# EAGLE design BABYBEAR (EAGLE 9.2.1)
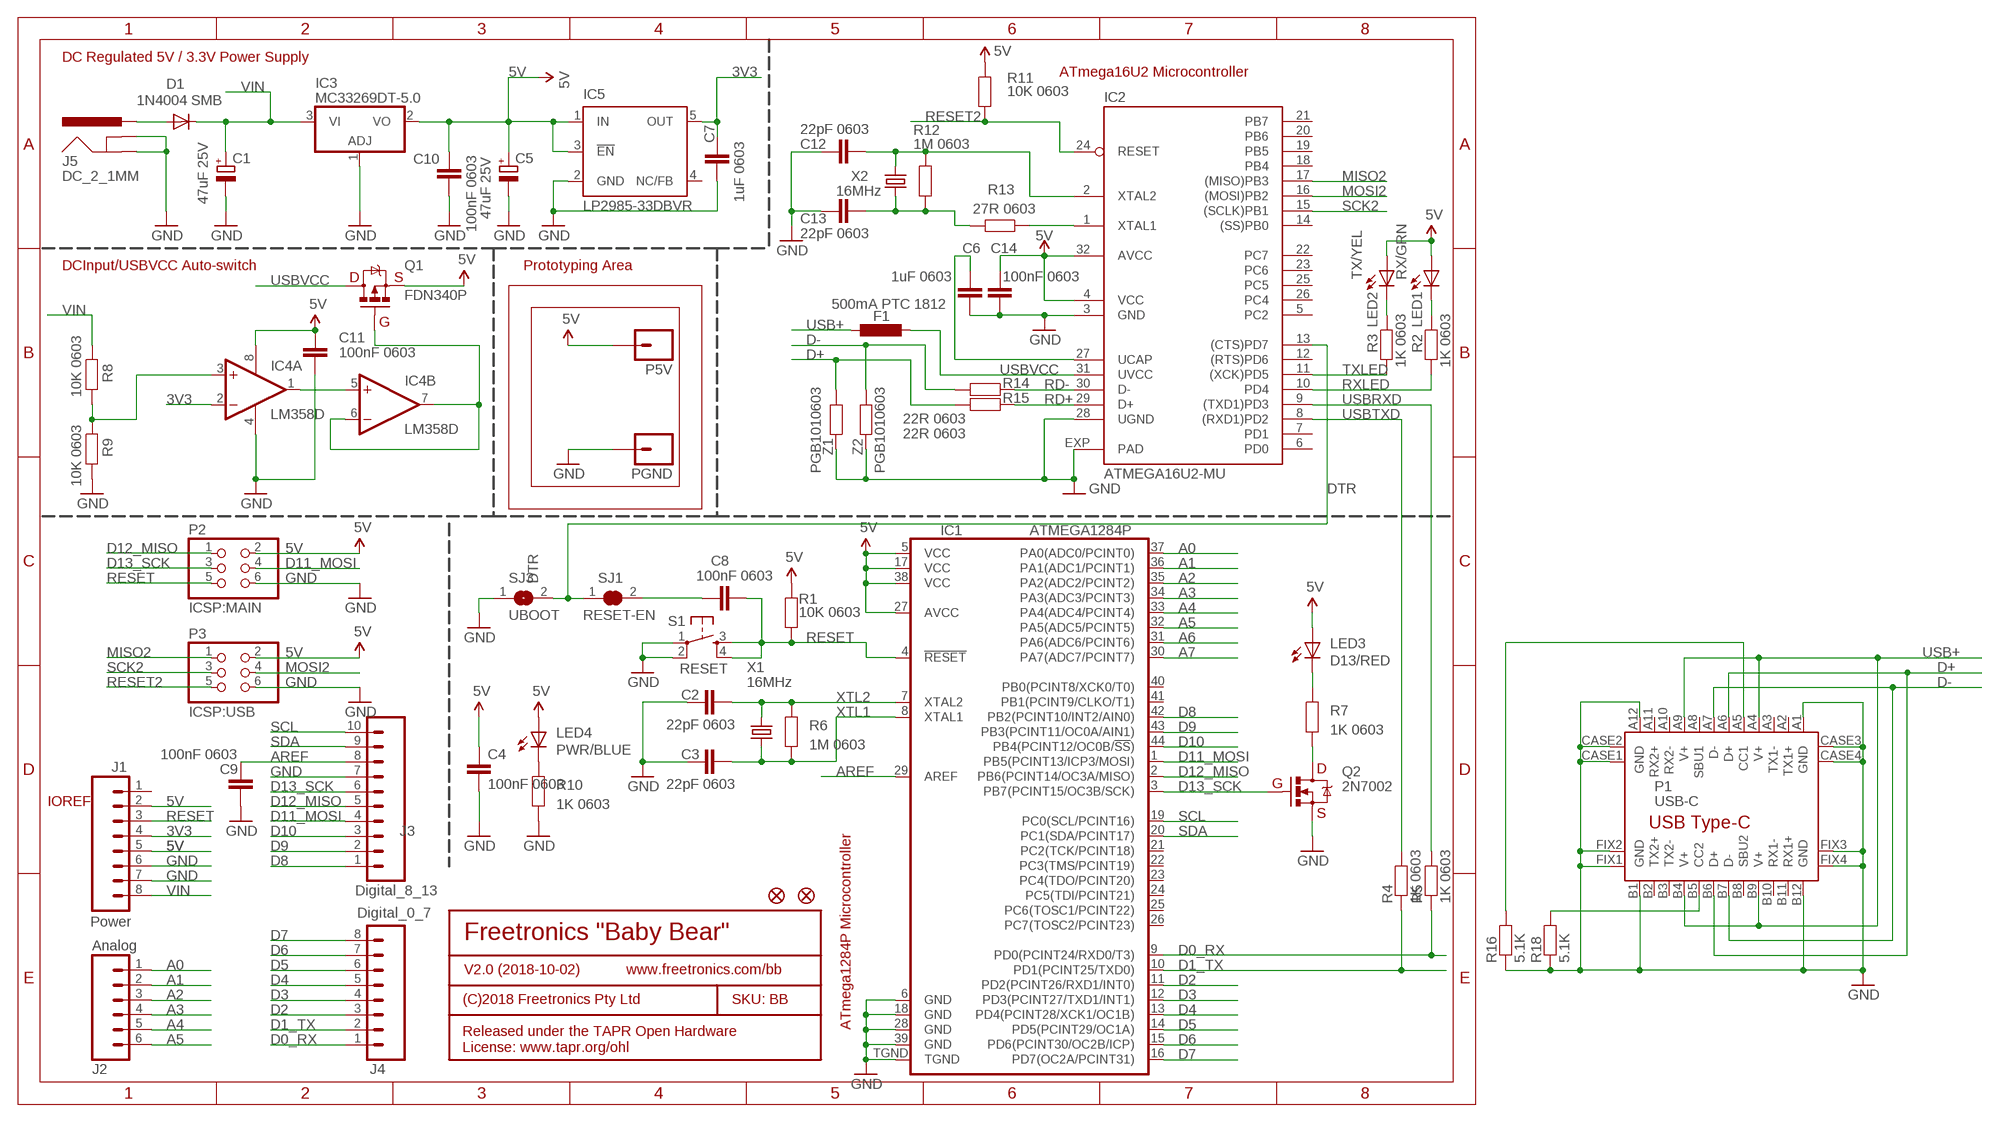
[diagram p0: schematic, sheet 1]

## Parts
C1  47uF 25V  CPOL-EUD  [PANASONIC_D]
C2  22pF 0603  CAP0603  [0603]
C3  22pF 0603  CAP0603  [0603]
C4  100nF 0603  CAP0603  [0603]
C5  47uF 25V  CPOL-EUD  [PANASONIC_D]
C6  1uF 0603  CAP0603  [0603]
C7  1uF 0603  CAP0603  [0603]
C8  100nF 0603  CAP0603  [0603]
C9  100nF 0603  CAP0603  [0603]
C10  100nF 0603  CAP0603  [0603]
C11  100nF 0603  CAP0603  [0603]
C12  22pF 0603  CAP0603  [0603]
C13  22pF 0603  CAP0603  [0603]
C14  100nF 0603  CAP0603  [0603]
D1  1N4004 SMB  DIODESMB  [SMB-DIODE]
F1  500mA PTC 1812  L-EUL1812  [L1812]
IC1  ATMEGA1284P  [QFN-44M1]
IC2  ATMEGA16U2-MU  ATMEL_ATMEGA8U2-MUQFN  [ATMEL_QFN32]
IC3  MC33269DT-5.0  MC33269D-5.0  [DPACK]
IC4  LM358D  [SO08]
IC5  LP2985-33DBVR  TEXAS_TPS77033  [TEXAS_SOT23-DBV]
J1  Power  M08  [1X08]
J2  Analog  M06SIP  [1X06]
J3  Digital_8_13  M100.1  [1X10]
J4  Digital_0_7  M08  [1X08]
J5  DC_2_1MM  POWER_JACKPTH_SLOTS  [POWER_JACK_PTH_SLOTS]
LED1  RX/GRN  LED0603  [LED-0603]
LED2  TX/YEL  LED0603  [LED-0603]
LED3  D13/RED  LED0603  [LED-0603]
LED4  PWR/BLUE  LED0603  [LED-0603]
P1  USB-C  [USB-C-U52A]
P2  ICSP:MAIN  PINHD-2X3  [2X03]
P3  ICSP:USB  PINHD-2X3  [2X03]
P5V  M01SMD  [LUXEON-PAD]
PGND  M01SMD  [LUXEON-PAD]
Q1  FDN340P  MOSFET-PCHANNEL  [SOT23]
Q2  2N7002  MOSFET-NCHANNELSMD  [SOT23-3]
R1  10K 0603  RESISTOR0603  [0603]
R2  1K 0603  RESISTOR0603  [0603]
R3  1K 0603  RESISTOR0603  [0603]
R4  1K 0603  RESISTOR0603  [0603]
R5  1K 0603  RESISTOR0603  [0603]
R6  1M 0603  RESISTOR0603  [0603]
R7  1K 0603  RESISTOR0603  [0603]
R8  10K 0603  RESISTOR0603  [0603]
R9  10K 0603  RESISTOR0603  [0603]
R10  1K 0603  RESISTOR0603  [0603]
R11  10K 0603  RESISTOR0603  [0603]
R12  1M 0603  RESISTOR0603  [0603]
R13  27R 0603  RESISTOR0603  [0603]
R14  22R 0603  RESISTOR0603  [0603]
R15  22R 0603  RESISTOR0603  [0603]
R16  5.1K  RESISTOR0603  [0603]
R18  5.1K  RESISTOR0603  [0603]
S1  RESET  TAC_SWITCHSMD  [TACTILE_SWITCH_SMD]
SJ1  RESET-EN  SJCN  [SJC]
SJ3  UBOOT  SJ  [SJ]
U$5  FIDUCIAL1X2.5  [FIDUCIAL-1X2.5]
U$14  FIDUCIAL1X2.5  [FIDUCIAL-1X2.5]
X1  16MHz  CRYSTALHC49UV  [HC49U-V]
X2  16MHz  CRYSTALHC49UV  [HC49U-V]
Z1  PGB1010603  RESISTOR0603  [0603]
Z2  PGB1010603  RESISTOR0603  [0603]

## Nets
3V3: C7.2 IC4.2(A:-IN) IC5.5(OUT) J1.4
5V: C4.1 C5.+ C10.1 C11.1 C14.1 IC1.5(VCC) IC1.17(VCC) IC1.27(AVCC) IC1.38(VCC) IC2.4(VCC) IC2.32(AVCC) IC3.2(VO) IC4.8(P:V+) IC5.1(IN) IC5.3(!EN) J1.2 J1.5 LED1.A LED2.A LED3.A LED4.A P2.2 P3.2 P5V.P$1 Q1.2(S) R1.2 R11.2
A0: IC1.37(PA0(ADC0/PCINT0)) J2.1
A1: IC1.36(PA1(ADC1/PCINT1)) J2.2
A2: IC1.35(PA2(ADC2/PCINT2)) J2.3
A3: IC1.34(PA3(ADC3/PCINT3)) J2.4
A4: IC1.33(PA4(ADC4/PCINT4)) J2.5
A5: IC1.32(PA5(ADC5/PCINT5)) J2.6
A6: IC1.31(PA6(ADC6/PCINT6))
A7: IC1.30(PA7(ADC7/PCINT7))
AREF: C9.1 IC1.29(AREF) J3.8
D0_RX: IC1.9(PD0(PCINT24/RXD0/T3)) J4.1 R5.1
D1_TX: IC1.10(PD1(PCINT25/TXD0)) J4.2 R4.1
D2: IC1.11(PD2(PCINT26/RXD1/INT0)) J4.3
D3: IC1.12(PD3(PCINT27/TXD1/INT1)) J4.4
D4: IC1.13(PD4(PCINT28/XCK1/OC1B)) J4.5
D5: IC1.14(PD5(PCINT29/OC1A)) J4.6
D6: IC1.15(PD6(PCINT30/OC2B/ICP)) J4.7
D7: IC1.16(PD7(OC2A/PCINT31)) J4.8
D8: IC1.42(PB2(PCINT10/INT2/AIN0)) J3.1
D9: IC1.43(PB3(PCINT11/OC0A/AIN1)) J3.2
D10: IC1.44(PB4(PCINT12/OC0B/!SS!)) J3.3
D11_MOSI: IC1.1(PB5(PCINT13/ICP3/MOSI)) J3.4 P2.4
D12_MISO: IC1.2(PB6(PCINT14/OC3A/MISO)) J3.5 P2.1
D13_SCK: IC1.3(PB7(PCINT15/OC3B/SCK)) J3.6 P2.3 Q2.1(G)
D+: P1.A6(D+) P1.B6(D+) R15.2 Z1.1
D-: P1.A7(D-) P1.B7(D-) R14.2 Z2.1
DTR: IC2.13((CTS)PD7) SJ1.1 SJ3.2
GND: C1.- C2.1 C3.1 C4.2 C5.- C6.2 C7.1 C9.2 C10.2 C11.2 C12.1 C13.1 C14.2 IC1.6(GND) IC1.18(GND) IC1.28(GND) IC1.39(GND) IC1.TGND IC2.3(GND) IC2.28(UGND) IC2.EXP(PAD) IC3.1(ADJ) IC4.4(P:V-) IC5.2(GND) J1.6 J1.7 J3.7 J5.GND J5.GNDBREAK P1.A1(GND) P1.A12(GND) P1.B1(GND) P1.B12(GND) P1.CASE1(GND) P1.CASE2(GND) P1.CASE3(GND) P1.CASE4(GND) P1.FIX1(GND) P1.FIX2(GND) P1.FIX3(GND) P1.FIX4(GND) P2.6 P3.6 PGND.P$1 Q2.2(S) R9.1 R10.1 R16.1 R18.1 S1.1 S1.2 SJ3.1 Z1.2 Z2.2
MISO2: IC2.17((MISO)PB3) P3.1
MOSI2: IC2.16((MOSI)PB2) P3.4
N$1: C8.1 SJ1.2
N$2: IC2.1(XTAL1) R13.1
N$3: P1.B5(CC2) R18.2
N$4: LED3.C R7.2
N$6: Q2.3(D) R7.1
N$7: P1.A5(CC1) R16.2
N$8: D1.A J5.PWR
N$9: IC4.3(A:+IN) R8.1 R9.2
N$10: IC4.1(A:OUT) IC4.5(B:+IN)
N$11: LED1.C R2.2
N$12: IC4.6(B:-IN) IC4.7(B:OUT) Q1.1(G)
N$13: LED2.C R3.2
N$14: LED4.C R10.2
N$113: C12.2 IC2.2(XTAL2) R12.2 X2.2
N$114: C13.2 R12.1 R13.2 X2.1
N$117: C6.1 IC2.27(UCAP)
RD+: IC2.29(D+) R15.1
RD-: IC2.30(D-) R14.1
RESET: C8.2 IC1.4(!RESET) J1.3 P2.5 R1.1 S1.3 S1.4
RESET2: IC2.24(RESET) P3.5 R11.1
RXLED: IC2.10(PD4) R2.1
SCK2: IC2.15((SCLK)PB1) P3.3
SCL: IC1.19(PC0(SCL/PCINT16)) J3.10
SDA: IC1.20(PC1(SDA/PCINT17)) J3.9
TXLED: IC2.11((XCK)PD5) R3.1
USB+: F1.1 P1.A4(V+) P1.A9(V+) P1.B4(V+) P1.B9(V+)
USBRXD: IC2.9((TXD1)PD3) R5.2
USBTXD: IC2.8((RXD1)PD2) R4.2
USBVCC: F1.2 IC2.31(UVCC) Q1.3(D)
VIN: C1.+ D1.C IC3.3(VI) J1.8 R8.2
XTL1: C3.2 IC1.8(XTAL1) R6.1 X1.1
XTL2: C2.2 IC1.7(XTAL2) R6.2 X1.2
Unconnected: IC1.21(PC2(TCK/PCINT18)) IC1.22(PC3(TMS/PCINT19)) IC1.23(PC4(TDO/PCINT20)) IC1.24(PC5(TDI/PCINT21)) IC1.25(PC6(TOSC1/PCINT22)) IC1.26(PC7(TOSC2/PCINT23)) IC1.40(PB0(PCINT8/XCK0/T0)) IC1.41(PB1(PCINT9/CLKO/T1)) IC2.5(PC2) IC2.6(PD0) IC2.7(PD1) IC2.12((RTS)PD6) IC2.14((SS)PB0) IC2.18(PB4) IC2.19(PB5) IC2.20(PB6) IC2.21(PB7) IC2.22(PC7) IC2.23(PC6) IC2.25(PC5) IC2.26(PC4) IC5.4(NC/FB) J1.1 P1.A2(TX1+) P1.A3(TX1-) P1.A8(SBU1) P1.A10(RX2-) P1.A11(RX2+) P1.B2(TX2+) P1.B3(TX2-) P1.B8(SBU2) P1.B10(RX1-) P1.B11(RX1+)

## Notes on the sheet
- DC Regulated 5V / 3.3V Power Supply
- ATmega16U2 Microcontroller
- DCInput/USBVCC Auto-switch | Prototyping Area
- D | S
- G
- D
- G
- IOREF
- S
- Freetronics "Baby Bear"
- V2.0 (2018-10-02) | www.freetronics.com/bb
- (C)2018 Freetronics Pty Ltd | SKU: BB
- ATmega1284P Microcontroller
- Released under the TAPR Open Hardware
  License: www.tapr.org/ohl

## Library data of the parts
C1 C5 = rcl:CPOL-EU: POLARIZED CAPACITOR, European symbol
C2-C4 C6-C14 = freetronics:CAP: Capacitor Standard 0603 ceramic capacitor, and 0.1" leaded capacitor.
D1 = freetronics:DIODE: Diode These are standard reverse protection diodes and small signal diodes. SMA package can handle up to about 1A. SOD-323 can handle about 200mA. What the SOD-323 package when ordering, there are some mfgs out there that are 5-pin packages.
F1 = rcl:L-EU: INDUCTOR, European symbol
IC1 = freetronics-jon:ATMEGA1284P
IC2 = freetronics-jon:ATMEL_ATMEGA8U2-MU
IC3 = linear:MC33269?*: Adjustable Output Low Dropout Voltage Regulator 800 mA Source: http://www.onsemi.com/pub/Collateral/MC33269-D.PDF
IC4 = linear:LM358: OP AMP also LM158; LM258; LM2904 Source: http://cache.national.com/ds/LM/LM158.pdf
IC5 = freetronics-jon:TEXAS_TPS770*: ULTRALOW-POWER 50-mA LOW-DROPOUT LINEAR REGULATORS 50-mA Low-Dropout Regulator Source: http://focus.ti.com/lit/ds/symlink/tps77001.pdf
J1 J4 = freetronics:M08: Header 8 Standard 8-pin 0.1" header. Use with straight break away headers (SKU : PRT-00116), right angle break away headers (PRT-00553), swiss pins (PRT-00743), machine pins (PRT-00117), and female headers (PRT-00115).
J2 = freetronics:M06: Header 6 Standard 6-pin 0.1" header. Use with straight break away headers (SKU : PRT-00116), right angle break away headers (PRT-00553), swiss pins (PRT-00743), machine pins (PRT-00117), and female headers (PRT-00115). Molex polarized connector foot print use with SKU : PRT-08094 with associated crimp pins and housings. NOTES ON THE VARIANTS LOCK and LOCK_LONGPADS... This footprint was designed to help hold the alignment of a through-hole component (i.e. 6-pin header) while soldering it into place. You may notice that each hole has been shifted either up or down by 0.005 of an inch from it's more standard position (which is a perfectly straight line). This slight alteration caused the pins (the squares in the middle) to touch the edges of the holes. Because they are alternating, it causes a "brace" to hold the component in place. 0.005 has proven to be the perfect amount of "off-center" position when using our standard breakaway headers. Although looks a little odd when you look at the bare footprint, once you have a header in there, the alteration is very hard to notice. Also, if you push a header all the way into place, it is covered up entirely on the bottom side. This idea of altering the position of holes to aid alignment will be further integrated into the Sparkfun Library for other footprints. It can help hold any component with 3 or more connection pins.
J3 = freetronics-original:M10: Header 10 Standard 10-pin 0.1" header. Use with straight break away headers (SKU : PRT-00116), right angle break away headers (PRT-00553), swiss pins (PRT-00743), machine pins (PRT-00117), and female headers (PRT-00115).
J5 = freetronics-jon:POWER_JACK: Power Jack This is the standard 5.5mm barrel jack for power. The PTH is the most common, proven, reliable, footprint. All others are experimental. The Slot footprint only works if the mill layer is transmitted to the PCB fab house so be warned. Spark Fun Electronics SKU : PRT-00119. Mating wall wart : TOL-00298 (and others)
LED1-LED4 = freetronics:LED: LEDs Standard schematic elements and footprints for 5mm, 3mm, 1206, and 0603 sized LEDs. 5mm - Spark Fun Electronics SKU : COM-00529 (and others)
P1 = freetronics-jon:USB-C
P2 P3 = pinhead:PINHD-2X3: PIN HEADER
P5V PGND = freetronics:M01: Header 1 Standard 1-pin 0.1" header. Use with straight break away headers (SKU : PRT-00116), right angle break away headers (PRT-00553), swiss pins (PRT-00743), machine pins (PRT-00117), and female headers (PRT-00115).
Q1 = freetronics-master-v1:MOSFET-PCHANNEL
Q2 = freetronics:MOSFET-NCHANNEL
R1-R15 Z1 Z2 = freetronics:RESISTOR: Resistor Basic schematic elements and footprints for 0603, 1206, and PTH 1/10th watt (small) resistors.
R16 R18 = freetronics-original:RESISTOR: Resistor Basic schematic elements and footprints for 0603, 1206, and PTH 1/10th watt (small) resistors.
S1 = freetronics:TAC_SWITCH: Momentary Switch Button commonly used for reset or general input. Spark Fun Electronics SKU : COM-00097
SJ1 = freetronics-jon:SJC
SJ3 = jumper:SJ: SMD solder JUMPER
U$5 U$14 = freetronics:FIDUCIAL: Fiducial Alignment Points Various fiducial points for machine vision alignment.
X1 X2 = freetronics-master-v1:CRYSTAL: Crystals Various standard crystals. Proven footprints. Spark Fun Electronics SKU : COM-00534

## Board
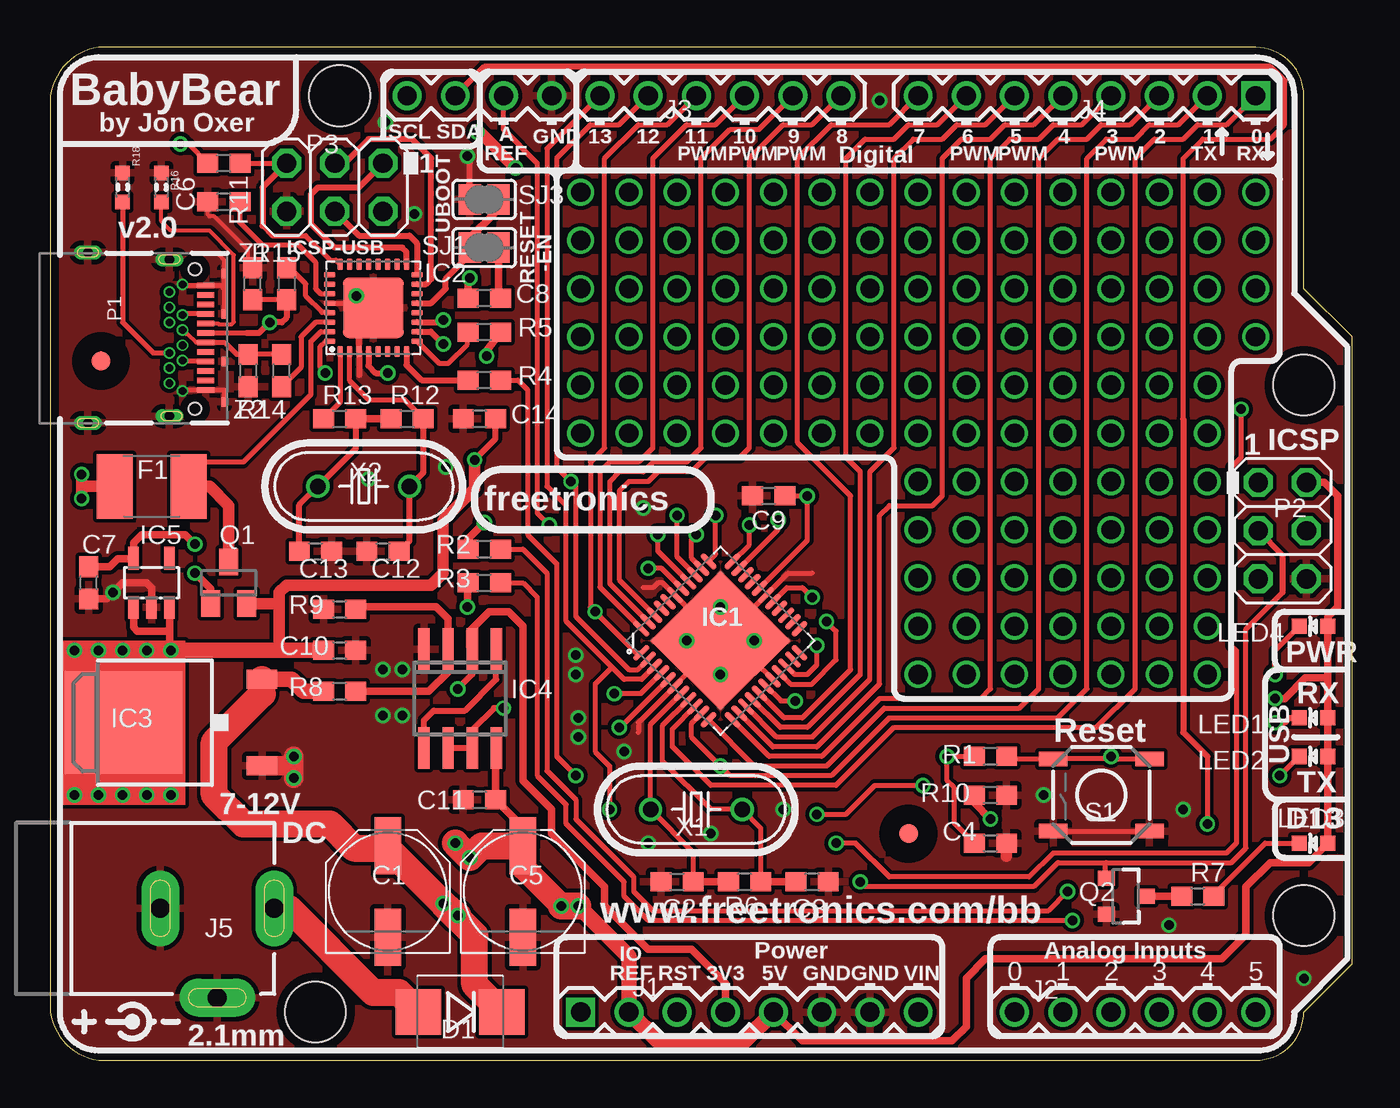
[diagram p1: board, top side]
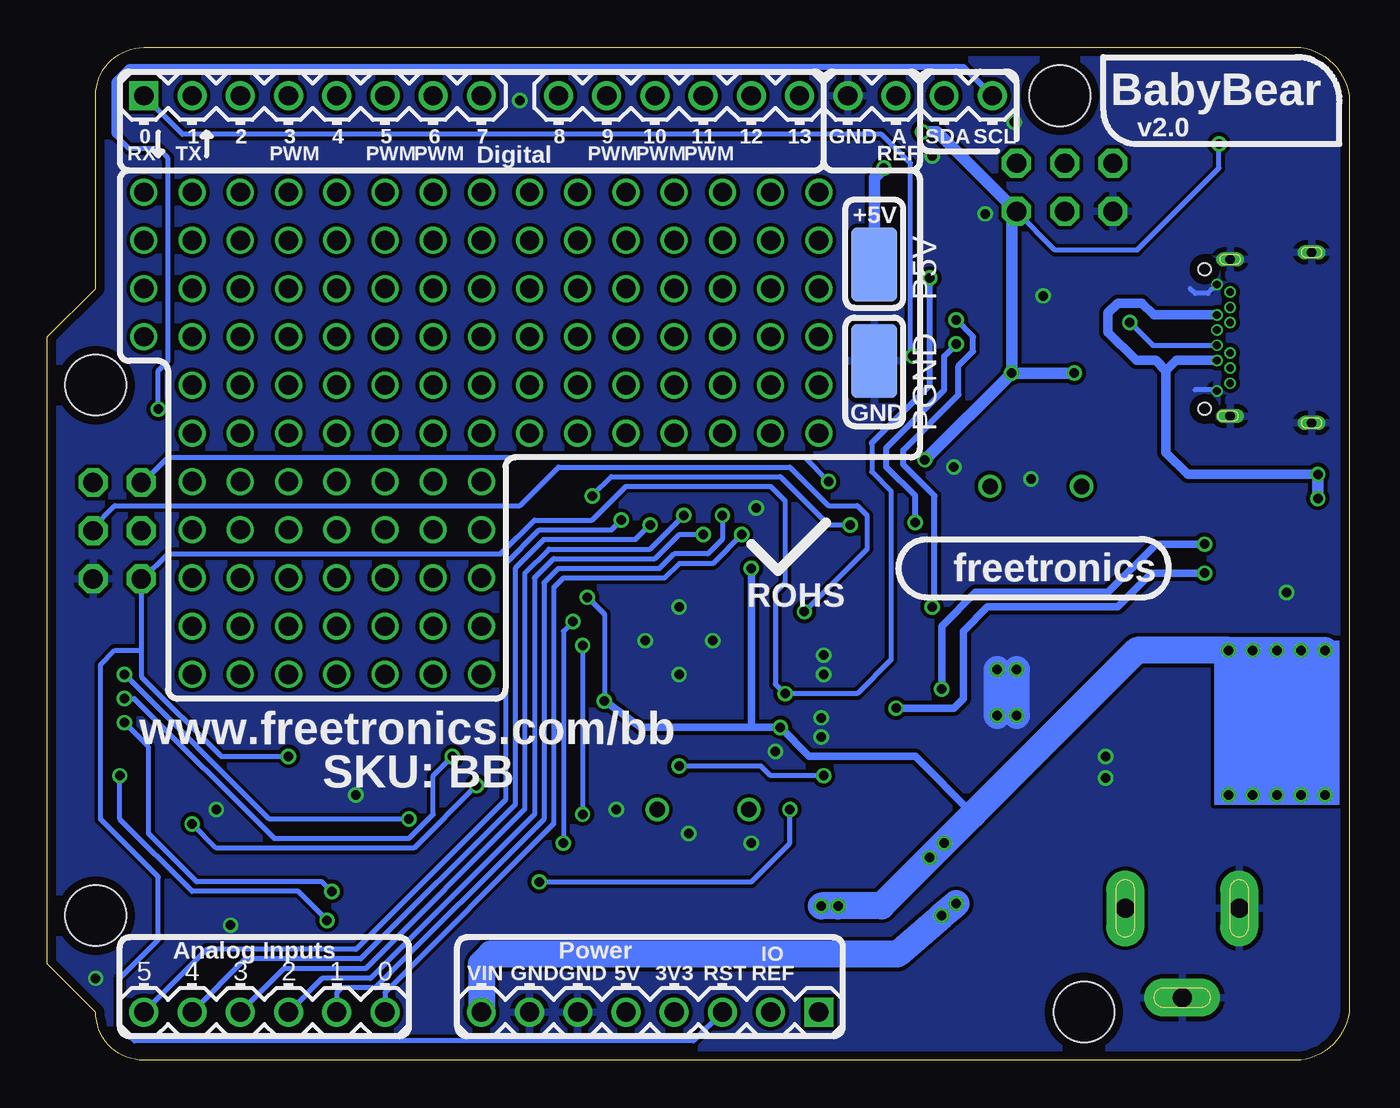
[diagram p2: board, bottom side, seen from below]

Size 68.58 x 53.34 mm. Coordinates in mm from the lower left corner, seen from the top.
Outline: 0,2.54 arc74 2.54,0 63.5,0 arc90 66.04,2.54 68.58,5.08 68.58,38.1 66.04,40.64 66.04,50.8 arc90 63.5,53.34 2.54,53.34 arc74 0,50.8 0,2.54
Copper layers (1*16): Top 0.035mm / dielectric 1.5mm / Bottom 0.035mm
Design rules "USB-C-design-rules": minimum track width 8mil, minimum drill 15mil, track to track 8mil, track to pad 8mil, pad to pad 8mil, via to via 8mil, smd to smd 6mil, copper to edge 18mil, drill to drill 8mil, minimum pad ring 4mil, minimum via ring 6mil, stop-mask expansion 4mil, vias tented up to drill 25mil, thermal gap 10mil
Holes 3.2 mm at 66.04,35.56 66.04,7.62 15.24,50.8 13.97,2.54
tRestrict: area 1.7,35.8 to 3.7,37.8; area 44.2,10.9 to 46.2,13

### Footprints (pad centres in the part's own frame; a part is rotated, then mirrored left to right if it is on the bottom)
PANASONIC_D = smd 3 x 1.4: + 2.4,0; - -2.4,0
0603 = smd 1.1 x 1: 1 -0.85,0; 2 0.85,0
SMB-DIODE = smd 2.4 x 2.4: A 2.2,0; C -2.2,0
L1812 = smd 1.9 x 3.4: 1 -1.95,0; 2 1.95,0
QFN-44M1 = smd 0.3 x 1.05: 1 -2.5,-3.4; 2 -2,-3.4; 3 -1.5,-3.4; 4 -1,-3.4; 5 -0.5,-3.4; 6 0,-3.4; 7 0.5,-3.4; 8 1,-3.4; 9 1.5,-3.4; 10 2,-3.4; 11 2.5,-3.4; 23 2.5,3.4; 24 2,3.4; 25 1.5,3.4; 26 1,3.4; 27 0.5,3.4; 28 0,3.4; 29 -0.5,3.4; 30 -1,3.4; 31 -1.5,3.4; 32 -2,3.4; 33 -2.5,3.4 | smd 1.05 x 0.3: 12 3.4,-2.5; 13 3.4,-2; 14 3.4,-1.5; 15 3.4,-1; 16 3.4,-0.5; 17 3.4,0; 18 3.4,0.5; 19 3.4,1; 20 3.4,1.5; 21 3.4,2; 22 3.4,2.5; 34 -3.4,2.5; 35 -3.4,2; 36 -3.4,1.5; 37 -3.4,1; 38 -3.4,0.5; 39 -3.4,0; 40 -3.4,-0.5; 41 -3.4,-1; 42 -3.4,-1.5; 43 -3.4,-2; 44 -3.4,-2.5 | smd 5.2 x 5.2: TGND 0,0
ATMEL_QFN32 = smd 0.6 x 0.3: 1 -2.3,1.75; 2 -2.3,1.25; 3 -2.3,0.75; 4 -2.3,0.25; 5 -2.3,-0.25; 6 -2.3,-0.75; 7 -2.3,-1.25; 8 -2.3,-1.75; 17 2.3,-1.75; 18 2.3,-1.25; 19 2.3,-0.75; 20 2.3,-0.25; 21 2.3,0.25; 22 2.3,0.75; 23 2.3,1.25; 24 2.3,1.75 | smd 0.3 x 0.6: 9 -1.75,-2.3; 10 -1.25,-2.3; 11 -0.75,-2.3; 12 -0.25,-2.3; 13 0.25,-2.3; 14 0.75,-2.3; 15 1.25,-2.3; 16 1.75,-2.3; 25 1.75,2.3; 26 1.25,2.3; 27 0.75,2.3; 28 0.25,2.3; 29 -0.25,2.3; 30 -0.75,2.3; 31 -1.25,2.3; 32 -1.75,2.3 | smd 3.2 x 3.2: EXP 0,0
DPACK = smd 1 x 1.6: 1 -2.28,-4.8; 3 2.28,-4.8 | smd 5.4 x 6.2: 2 0,2.5
SO08 = smd 0.6 x 2.2: 1 -1.905,-2.6; 2 -0.635,-2.6; 3 0.635,-2.6; 4 1.905,-2.6; 5 1.905,2.6; 6 0.635,2.6; 7 -0.635,2.6; 8 -1.905,2.6
TEXAS_SOT23-DBV = smd 0.55 x 1.2: 1 -0.95,-1.3; 2 0,-1.3; 3 0.95,-1.3; 4 0.95,1.3; 5 -0.95,1.3
1X08 = drill 1.016 square: 1 0,0 | drill 1.016: 2 2.54,0; 3 5.08,0; 4 7.62,0; 5 10.16,0; 6 12.7,0; 7 15.24,0; 8 17.78,0
1X06 = drill 1.016: 1 0,0; 2 2.54,0; 3 5.08,0; 4 7.62,0; 5 10.16,0; 6 12.7,0
1X10 = drill 1.016: 1 0,0; 2 2.54,0; 3 5.08,0; 4 7.62,0; 5 10.16,0; 6 12.7,0; 7 15.24,0; 8 17.78,0; 9 20.32,0; 10 22.86,0
POWER_JACK_PTH_SLOTS = drill 1 pad 2 long: GND 0,7.7; GNDBREAK 4.7,10.7; PWR 0,13.7
LED-0603 = smd 0.8 x 0.8: A 0,-0.75; C 0,0.75
USB-C-U52A = smd 0.3 x 0.9: A1 0.85,0.56; A2 1.35,0.56; A3 1.85,0.56; A4 2.35,0.56; A5 2.85,0.56; A6 3.35,0.56; A7 3.85,0.56; A8 4.35,0.56; A9 4.85,0.56; A10 5.35,0.56; A11 5.85,0.56; A12 6.35,0.56 | drill 0.4 pad 0.6: B1 6.4,-0.65; B2 6,-1.35; B3 5.2,-1.35; B4 4.8,-0.65; B5 4.4,-1.35; B6 4,-0.65; B7 3.2,-0.65; B8 2.8,-1.35; B9 2.4,-0.65; B10 2,-1.35; B11 1.2,-1.35; B12 0.8,-0.65 | smd 0.5 x 0.3: CASE1 0.23,1.55; CASE2 2.35,1.55; CASE3 4.85,1.55; CASE4 6.98,1.55 | drill 0.5 pad 0.7 long: FIX1 -0.89,-5.64; FIX2 -0.53,-1.35; FIX3 7.73,-1.35; FIX4 8.09,-5.64 | hole 0.65: 7.35,0; 0,0
2X03 = drill 1.016 octagon: 1 -2.54,-1.27; 2 -2.54,1.27; 3 0,-1.27; 4 0,1.27; 5 2.54,-1.27; 6 2.54,1.27
LUXEON-PAD = smd 3.9 x 2.4: P$1 0,0
SOT23 = smd 1 x 1.4: 1 -0.95,-1.1; 2 0.95,-1.1; 3 0,1.1
SOT23-3 = smd 0.8 x 0.9: 1 -0.95,-1; 2 0.95,-1; 3 0,1.1
0603' = smd 0.762 x 0.762: 1 -0.762,0; 2 0.762,0
TACTILE_SWITCH_SMD = smd 1.524 x 0.762: 1 -2.54,1.905; 2 2.54,1.905; 3 -2.54,-1.905; 4 2.54,-1.905
SJC = smd 1.168 x 1.6: 1 -0.762,0; 2 0.762,0
SJ = smd 1.168 x 1.6: 1 -0.762,0; 2 0.762,0
FIDUCIAL-1X2.5 = smd 1 x 1: 1 0,0
HC49U-V = drill 0.813: 1 -2.413,0; 2 2.413,0

### Placement (x,y rotation side)
C1  17.78,8.89 90 top
C2  33.02,9.4 0 top
C3  40.13,9.4 180 top
C4  49.53,11.43 0 top
C5  24.89,8.89 90 top
C6  9.14,45.21 180 top
C7  2.03,25.15 90 top
C8  22.86,40.13 180 top
C9  37.85,29.72 180 top
C10  15.24,21.59 0 top
C11  22.61,13.72 180 top
C12  17.53,26.8 0 top
C13  13.97,26.8 180 top
C14  22.61,33.78 180 top
D1  21.59,2.54 180 top
F1  5.33,30.23 0 top
IC1  35.31,22.1 315 top
IC2  17.02,39.62 90 top
IC3  6.35,17.78 90 top
IC4  21.59,19.05 180 top
IC5  5.33,25.15 0 top
J1  27.94,2.54 0 top
J2  50.8,2.54 0 top
J3  41.66,50.8 180 top
J4  63.5,50.8 180 top
J5  -1.91,8 270 top
LED1  66.55,18.03 90 top
LED2  66.55,16 90 top
LED3  66.55,11.43 90 top
LED4  66.55,22.86 90 top
P1  7.62,41.66 270 top
P2  64.91,27.89 270 top
P3  14.99,45.97 180 top
P5V  25.02,41.91 270 bottom
PGND  25.02,36.83 270 bottom
Q1  9.4,25.15 0 top
Q2  56.64,8.64 270 top
R1  49.53,16 180 top
R2  22.86,26.92 0 top
R3  22.86,25.15 0 top
R4  22.86,35.81 180 top
R5  22.86,38.35 180 top
R6  36.58,9.4 180 top
R7  60.45,8.64 0 top
R8  15.24,19.43 180 top
R9  15.24,23.75 0 top
R10  49.53,13.97 180 top
R11  9.14,47.24 180 top
R12  18.8,33.78 0 top
R13  15.24,33.78 0 top
R14  12.19,36.32 90 top
R15  12.45,40.89 270 top
R16  5.1K  [0603']  5.84,45.97 270 top
R18  5.1K  [0603']  3.81,45.97 270 top
S1  55.37,13.97 180 top
SJ1  22.86,42.8 0 top
SJ3  22.86,45.34 0 top
U$5  2.67,36.83 0 top
U$14  45.21,11.94 0 top
X1  34.04,13.21 180 top
X2  16.51,30.23 0 top
Z1  10.67,40.89 90 top
Z2  10.41,36.32 270 top

### Tracks (layer width: path | path; a pad name or v marks a point on that pad's centre or on a via)
3V3  (via drill 0.5)
  Top 0.305: v21.46,19.56 22.23,20.32 IC4.2
  Top 0.406: C7.2 3.14,26 3.56,26.42 4.35,26.42 IC5.5 4.38,27.24 4.83,27.69 7.11,27.69 v7.62,27.18 | IC4.2 22.1,21.78 22.1,22.61 23.11,23.62 24.13,23.62 24.89,22.86 24.89,14.73 26.42,13.21 26.42,11.94 29.21,9.14 29.21,8.13 31.5,5.84 33.78,5.84 35.56,4.06 J1.4
  Bottom 0.406: v7.62,27.18 10.16,27.18 12.7,24.64 19.68,24.64 21.46,22.86 v21.46,19.56
5V  (via drill 0.5)
  Top 0.254: IC2.32 14.51,37.87 14.22,37.59 14.22,36.5 v14.48,36.2 | 12.06,24.13 11.98,24.05 | IC1.38 32.2,25.91 v31.5,25.91 | IC1.17 38.48,18.92 v39.24,18.92 | IC1.5 30.03,17.53 v29.97,17.53 | LED3.A 67.3,11.42 | R1.2 v47.24,16 47.24,14.73 47.62,14.35 47.62,12.48 C4.1 | IC1.27 38.81,24.89 39.62,24.89 v40.13,24.38 | R11.2 7.28,48.26 v6.86,48.26
  Top 0.305: IC2.4 16.77,36.58 16.76,36.58 17.14,36.2 v17.78,36.2 | v22.35,31.62 23.46,32.73 C14.1
  Top 0.406: IC4.8 23.46,16.41 C11.1 24.64,12.53 | 24.89,10.16 24.64,12.53 | LED3.A LED2.A LED1.A 67.3,20.15 | 67.3,20.15 LED4.A 67.3,23.36 67.82,23.88 67.82,29.72 67.11,30.43 P2.2 | 67.3,20.15 66.12,20.15 65.02,19.05 v64.52,19.05 | IC5.1 4.38,22.79 4.57,22.61 6.22,22.61 6.28,22.67 | 6.28,22.67 IC5.3 | 24.64,12.53 24.89,12.28 C5.+ | 67.3,11.42 66.29,10.41 64.26,10.41 62.99,9.14 62.99,6.6 61.72,5.33 49.28,5.33 48.26,4.32 48.26,1.78 47.5,1.02 39.62,1.02 J1.5 | 6.28,22.67 6.28,21.66 v6.35,21.59 | v5.08,21.59 5.08,19.3
  Top 0.61: 12.06,21.59 12.06,24.13 12.06,24.64 12.45,25.02 20.07,25.02 20.7,25.65 20.7,28.45 22.35,30.1 v22.35,31.62 | 11.98,24.05 Q1.2 | v24.51,46.99 22.61,48.9 v22.48,48.9
  Top 0.813: v5.08,21.59 v6.35,21.59 12.06,21.59 C10.1 | J1.5 36.58,1.02 32,1.02 J1.2 30.48,5.46 v27.81,8.13
  Top 1.016: IC3.2 3.85,18.07 5.08,19.3
  Top 1.27: v26.92,8.13 24.89,10.16
  Top 1.422: v26.92,8.13 v27.8,8.13 | v21.34,11.43 v22.1,10.67 22.72,11.29 C5.+
  Bottom 0.254: v64.52,19.05 64.01,19.05 56.64,11.68 49.53,11.68 48.26,12.95 48.26,14.99 v47.24,16 | v40.13,24.38 39.24,23.5 v39.24,18.92 | v6.86,48.26 6.86,46.99 11.18,42.67 15.49,42.67 P3.2
  Bottom 0.406: 19.81,12.95 22.86,16 28.45,16 v29.97,17.53 31.5,17.53 | v39.24,18.92 37.34,17.53 31.5,17.53 | v31.5,25.91 31.5,17.53
  Bottom 0.61: v22.48,48.9 21.72,48.9 P3.2 17.78,44.45 v17.78,36.2 | P5V.P$1 25.02,46.48 v24.51,46.99 | v22.35,31.62 v17.78,36.2 | v14.48,36.2 v17.78,36.2
  Bottom 1.422: v27.81,8.13 v26.92,8.13 24.64,8.13 19.81,12.95 11.18,21.59 v6.35,21.59 1.27,21.59
A0  (via drill 0.5)
  Top 0.254: IC1.37 32,26.81 v32,27.69
  Bottom 0.254: v32,27.69 33.53,26.16 35.31,26.16 36.07,25.4 41.4,25.4 41.91,24.89 41.91,12.45 50.8,3.56 J2.1
A1  (via drill 0.5)
  Top 0.254: IC1.36 33.02,26.5 v33.02,28.7
  Bottom 0.254: v33.02,28.7 33.02,27.43 33.78,26.67 35.56,26.67 36.32,25.91 41.66,25.91 42.42,25.15 42.42,12.7 51.31,3.81 53.09,3.81 53.34,3.56 J2.2
A2  (via drill 0.5)
  Top 0.254: IC1.35 33.78,26.45 33.78,27.43 v34.04,27.69
  Bottom 0.254: J2.3 54.1,4.32 51.56,4.32 42.93,12.95 42.93,25.4 41.91,26.42 36.58,26.42 35.31,27.69 v34.04,27.69
A3  (via drill 0.5)
  Top 0.254: IC1.34 35.05,26.65 v35.05,28.7
  Bottom 0.254: J2.4 56.13,4.83 51.82,4.83 43.43,13.21 43.43,25.65 42.16,26.92 36.83,26.92 v35.05,28.7
A4  (via drill 0.5)
  Top 0.254: IC1.33 36.83,27.16 v36.83,28.19
  Bottom 0.254: J2.5 58.17,5.33 52.07,5.33 43.94,13.46 43.94,25.91 42.42,27.43 37.59,27.43 v36.83,28.19
A5  (via drill 0.5)
  Top 0.254: IC1.32 38.35,27.97 v38.35,28.45
  Bottom 0.254: J2.6 60.2,5.84 52.32,5.84 44.45,13.72 44.45,26.16 42.67,27.94 38.86,27.94 v38.35,28.45
AREF  (via drill 0.5)
  Top 0.254: v26.29,28.19 25.65,28.83 25.65,47.24 23.88,49.02 J3.8 | C9.1 v39.88,29.72 39.88,27.38 IC1.29
  Bottom 0.254: v39.88,29.72 38.86,30.73 29.97,30.73 27.43,28.19 v26.29,28.19
D0_RX  (via drill 0.5)
  Top 0.254: IC1.9 32.77,17.44 32.77,16.51 34.8,14.48 41.4,14.48 44.45,17.53 55.12,17.53 57.15,19.56 57.15,47.5 58.17,48.51 59.69,48.51 60.45,49.28 61.98,49.28 J4.1
  Top 0.406: v22.99,37.08 22.99,37.38 R5.1
  Bottom 0.254: v22.99,37.08 23.11,37.21 23.11,47.24 24.64,48.77 61.47,48.77 J4.1
D1_TX  (via drill 0.5)
  Top 0.254: IC1.10 33.78,17.75 33.78,17.02 v35.31,15.49 35.81,14.99 41.15,14.99 44.2,18.03 53.09,18.03 54.61,19.56 54.61,47.5 55.63,48.51 57.15,48.51 57.91,49.28 59.44,49.28 J4.2 | R4.1 24.64,35.81 25.15,35.31 25.15,27.69 26.67,26.16 26.67,16 v27.69,14.99
  Bottom 0.254: v27.69,14.99 30.48,14.99 30.99,15.49 v35.31,15.49
D2
  Top 0.254: IC1.11 37.1,15.49 40.89,15.49 43.94,18.54 51.05,18.54 52.07,19.56 52.07,47.5 53.09,48.51 54.61,48.51 55.37,49.28 56.9,49.28 J4.3
D3
  Top 0.254: IC1.12 37.87,16 40.64,16 43.69,19.05 49.02,19.05 49.53,19.56 49.53,47.5 50.55,48.51 52.07,48.51 52.83,49.28 54.36,49.28 J4.4
D4
  Top 0.254: IC1.13 38.07,16.51 40.39,16.51 43.69,19.81 43.69,28.7 44.2,29.21 46.48,29.21 46.99,29.72 46.99,47.5 48.01,48.51 49.53,48.51 50.29,49.28 51.82,49.28 J4.5
D5
  Top 0.254: IC1.14 38.27,17.02 40.13,17.02 43.18,20.07 43.18,30.99 44.45,32.26 44.45,47.5 45.47,48.51 46.99,48.51 47.75,49.28 49.28,49.28 J4.6
D6
  Top 0.254: IC1.15 38.46,17.53 39.88,17.53 42.67,20.32 42.67,30.99 41.91,31.75 41.91,47.5 42.93,48.51 44.45,48.51 45.21,49.28 46.74,49.28 J4.7
D7
  Top 0.254: IC1.16 38.66,18.03 39.62,18.03 42.16,20.57 42.16,29.72 39.37,32.51 39.37,47.5 41.15,49.28 44.2,49.28 J4.8
D8
  Top 0.254: IC1.42 29.97,25.31 29.97,29.97 30.48,30.48 31.5,30.48 32,30.99 33.78,30.99 34.54,31.75 36.32,31.75 36.83,32.26 36.83,47.5 38.61,49.28 40.13,49.28 J3.1
D9
  Top 0.254: IC1.43 29.46,25.11 29.46,30.48 29.97,30.99 31.24,30.99 31.75,31.5 33.53,31.5 34.29,32.26 34.29,47.5 35.81,49.02 37.34,49.02 J3.2
D10
  Top 0.254: IC1.44 28.96,24.91 28.96,30.99 29.46,31.5 30.99,31.5 31.75,32.26 31.75,47.5 33.53,49.28 35.05,49.28 J3.3
D11_MOSI  (via drill 0.5)
  Top 0.254: IC1.1 30.86,21.46 v28.7,23.62 28.45,23.88 28.45,31.5 29.21,32.26 29.21,47.5 30.99,49.28 32.51,49.28 J3.4
  Bottom 0.254: P2.4 66.18,28.05 65.02,29.21 43.69,29.21 41.66,31.24 29.46,31.24 27.43,29.21 25.91,29.21 25.4,28.7 25.4,26.92 v28.7,23.62
D12_MISO  (via drill 0.5)
  Top 0.254: IC1.2 30.95,20.57 30.48,20.57 27.69,23.37 27.69,30.23 v27.43,30.48 26.67,31.24 26.67,47.5 28.45,49.28 29.97,49.28 J3.5
  Bottom 0.254: 63.59,30.48 63.5,30.48 62.23,31.75 28.7,31.75 v27.43,30.48
  Bottom 0.305: 63.59,30.48 P2.1
D13_SCK  (via drill 0.5)
  Top 0.254: IC1.3 31.15,20.07 30.23,20.07 29.59,20.7 | 29.59,20.7 27.18,23.11 27.18,29.21 26.16,30.23 26.16,48.01 J3.6 | Q2.1 55.58,9.65 55.58,10.36 55.63,10.41 | 29.59,20.7 28.7,19.81 28.7,16.26 29.46,15.49 v29.46,13.21 | 55.63,10.41 53.09,10.41 51.82,9.14 42.93,9.14 v42.67,9.4 | 55.63,10.41 62.23,10.41 62.99,11.18 62.99,22.71 64.92,24.64
  Top 0.305: P2.3 64.92,26.57 64.92,24.64
  Bottom 0.254: v42.67,9.4 31.5,9.4 29.46,11.43 v29.46,13.21
D+  (via drill 0.5)
  Top 0.254: R15.2 Z1.1 | P1.A6 10.37,38.31
  Top 0.305: R15.2 12.45,39.12 12.19,38.86 v11.56,38.86 11,38.31 10.37,38.31
  Bottom 0.254: P1.B6 10.35,37.66 v11.56,38.86
D-
  Top 0.203: P1.B7 7.16,38.26 7.22,38.26 7.68,37.81 P1.A7
  Top 0.254: R14.2 Z2.1 9.82,37.17 9.18,37.81 P1.A7
DTR
  Top 0.254: 22.1,42.42 SJ1.1 22.1,43.31 | 23.37,44.58 23.37,45.09 SJ3.2
  Top 0.305: 22.1,42.42 20.83,41.15 20.83,40.64 20.06,39.87 IC2.13
  Top 0.406: 22.1,43.31 23.37,44.58
GND  (via drill 0.5)
  Top 0.203: Z1.2 10.41,42 10.41,42.67 8.64,44.45 8.38,44.45 8.29,44.54 C6.2 | P1.CASE2 9.17,40.67 | P1.CASE1 9.17,42.14 8.89,42.42
  Top 0.254: S1.2 S1.1 | 16.26,39.62 16.76,39.62 | IC1.18 37.08,21.03 v37.08,22.1 | v35.31,20.32 IC1.TGND v35.31,23.88 36.58,23.37 IC1.28 38.86,25.65 40.13,25.65 | 31.24,24.89 31.75,24.89 32,25.15 32.26,25.15 IC1.39 33.53,23.88 v33.53,22.1 33.53,20.32 IC1.6 30.99,17.78 30.99,17.27 | IC2.28 15.74,39.87 v16.13,40.26 | P1.CASE1 9.17,40.67 9.14,40.64 8.98,40.81 P1.A1 7.02,40.81 P1.B12 | P1.CASE4 9.17,35.28 9.14,35.31 P1.A12 7.02,35.31 P1.B1
  Top 0.305: SJ3.1 22.1,47.24 v21.97,47.62 | 16.27,36.08 IC2.3 16.27,39.13 16.76,39.62
  Top 0.406: IC5.2 5.33,24.89 5.08,25.15 3.81,25.15 v3.3,24.64 2.96,24.3 C7.1 | 16.26,39.62 IC2.EXP 16.76,39.62 v16.13,40.26
  Top 0.61: 50.38,10.76 C4.2
  Top 1.016: 12.83,15.5 v12.83,16 | 12.83,15.5 v12.83,14.86 | IC3.1 12.83,15.5
  Bottom 0.254: P1.B1 7.02,35.31 8.13,35.31 | 8.38,40.64 8.13,40.39 7.44,40.39 P1.B12
  Bottom 1.422: v18.54,18.16 v18.54,20.57 | v17.53,18.16 v17.53,20.57
  other vias: 20.83,31.24 16.76,30.61 31.24,29.08 17.65,49.4 27.69,21.34 30.23,16.26 43.69,50.55 58.93,7.11 59.69,13.21 52.32,13.97 38.61,13.21 27.81,18.03 27.81,17.02 27.69,20.32 31.5,11.43 19.18,44.58 66.04,4.32 34.8,11.94
  pour Bottom: 0,50.8 arc-74 2.54,53.34 63.5,53.34 arc-74 66.04,50.8 66.04,40.64 68.58,38.1 68.58,5.08 66.04,2.54 arc-74 63.5,0 2.54,0 arc-74 0,2.54
  pour Top: 0,50.8 arc-74 2.54,53.34 63.5,53.34 arc-74 66.04,50.8 66.04,40.64 68.58,38.1 68.58,5.08 66.04,2.54 arc-74 63.5,0 2.54,0 arc-74 0,2.54
MISO2
  Top 0.305: P3.1 16.26,45.97 14.1,45.97 13.72,45.59 13.72,44.07 14.99,42.8 18.54,42.8 18.77,42.57 IC2.17
MOSI2
  Top 0.305: P3.4 16.26,43.43 18.92,43.43 19.32,43.04 IC2.16
N$1
  Top 0.406: C8.1 23.62,40.22 SJ1.2
N$2
  Top 0.254: R13.1 15.27,34.66 IC2.1
N$3
  Top 0.254: P1.B5 5.42,37.26 3.81,38.86 R18.2
N$4
  Top 0.254: R7.2 61.3,8.72 64.01,11.43 LED3.C
N$5  (via drill 1.02)
  other vias: 50.8,30.48
N$6
  Top 0.406: Q2.3 R7.1
N$7
  Top 0.203: P1.A5 8.84,38.81 8.89,38.75 9.54,38.75 9.67,38.88 9.67,42.4 8.38,43.69 6.35,43.69 5.84,44.2 R16.2
N$8
  Top 1.422: D1.A 18.37,3.56 17.02,3.56 12.57,8 J5.PWR
N$9
  Top 0.406: R8.1 19.94,19.43 20.95,20.45 IC4.3 20.95,23.24 20.32,23.88 16.26,23.88 16.22,23.91 16.22,23.96 R9.2
N$10
  Top 0.305: IC4.5 19.68,17.91 20.19,18.41 21.84,18.41 23.5,20.07 IC4.1
N$11  (via drill 0.5)
  Top 0.254: R2.2 24.89,26.92 26.16,25.65 26.16,15.24 27.69,13.72 27.69,12.7 30.73,9.65 30.73,8.89 31.75,7.87 52.58,7.87 v53.59,8.89
  Top 0.305: LED1.C 65.28,18.03 65.02,17.78 v64.52,17.78
  Bottom 0.254: v53.59,8.89 54.1,9.4 60.71,9.4 63.25,11.94 63.25,16.51 v64.52,17.78
N$12  (via drill 0.5)
  Top 0.254: 22.16,16.45 22.23,16.38
  Top 0.305: 22.23,16.38 22.23,17.4 23.37,18.54 v23.88,18.54 | IC4.6 22.16,16.45
  Top 0.406: 22.23,16.38 IC4.7 | Q1.1 8.45,24.83 v7.62,25.65
  Bottom 0.406: v7.62,25.65 10.41,25.65 12.19,23.88 19.05,23.88 20.32,22.61 20.32,19.05 20.83,18.54 v23.88,18.54
N$13  (via drill 0.5)
  Top 0.254: R3.2 24.89,25.15 25.65,24.38 25.65,14.99 27.18,13.46 27.18,12.45 30.23,9.4 30.23,8.64 31.5,7.37 v53.85,7.37 | v64.77,14.99 65.54,15.76 LED2.C
  Bottom 0.254: v53.85,7.37 55.37,8.89 60.96,8.89 64.77,12.7 v64.77,14.99
N$14  (via drill 0.5)
  Top 0.254: LED4.C 64.52,21.58 v64.52,20.32
  Top 0.406: v49.53,12.7 48.68,13.55 R10.2
  Bottom 0.254: v64.52,20.32 56.9,12.7 v49.53,12.7
N$15  (via drill 1.02)
  other vias: 33.02,40.64
N$18  (via drill 1.02)
  other vias: 33.02,43.18
N$19  (via drill 1.02)
  other vias: 33.02,45.72
N$20  (via drill 1.02)
  other vias: 30.48,40.64
N$21  (via drill 1.02)
  other vias: 30.48,43.18
N$22  (via drill 1.02)
  other vias: 30.48,45.72
N$23  (via drill 1.02)
  other vias: 27.94,40.64
N$24  (via drill 1.02)
  other vias: 27.94,43.18
N$25  (via drill 1.02)
  other vias: 27.94,45.72
N$26  (via drill 1.02)
  other vias: 40.64,40.64
N$27  (via drill 1.02)
  other vias: 40.64,43.18
N$28  (via drill 1.02)
  other vias: 40.64,45.72
N$29  (via drill 1.02)
  other vias: 38.1,40.64
N$30  (via drill 1.02)
  other vias: 38.1,43.18
N$31  (via drill 1.02)
  other vias: 38.1,45.72
N$32  (via drill 1.02)
  other vias: 35.56,40.64
N$33  (via drill 1.02)
  other vias: 35.56,43.18
N$34  (via drill 1.02)
  other vias: 35.56,45.72
N$35  (via drill 1.02)
  other vias: 48.26,40.64
N$36  (via drill 1.02)
  other vias: 48.26,43.18
N$37  (via drill 1.02)
  other vias: 48.26,45.72
N$38  (via drill 1.02)
  other vias: 45.72,40.64
N$39  (via drill 1.02)
  other vias: 45.72,43.18
N$40  (via drill 1.02)
  other vias: 45.72,45.72
N$41  (via drill 1.02)
  other vias: 43.18,40.64
N$42  (via drill 1.02)
  other vias: 43.18,43.18
N$43  (via drill 1.02)
  other vias: 43.18,45.72
N$44  (via drill 1.02)
  other vias: 55.88,40.64
N$45  (via drill 1.02)
  other vias: 55.88,43.18
N$46  (via drill 1.02)
  other vias: 55.88,45.72
N$47  (via drill 1.02)
  other vias: 53.34,40.64
N$48  (via drill 1.02)
  other vias: 53.34,43.18
N$49  (via drill 1.02)
  other vias: 53.34,45.72
N$50  (via drill 1.02)
  other vias: 50.8,40.64
N$51  (via drill 1.02)
  other vias: 50.8,43.18
N$52  (via drill 1.02)
  other vias: 50.8,45.72
N$53  (via drill 1.02)
  other vias: 63.5,40.64
N$54  (via drill 1.02)
  other vias: 63.5,43.18
N$55  (via drill 1.02)
  other vias: 63.5,45.72
N$56  (via drill 1.02)
  other vias: 60.96,40.64
N$57  (via drill 1.02)
  other vias: 60.96,43.18
N$58  (via drill 1.02)
  other vias: 60.96,45.72
N$59  (via drill 1.02)
  other vias: 58.42,40.64
N$60  (via drill 1.02)
  other vias: 58.42,43.18
N$61  (via drill 1.02)
  other vias: 58.42,45.72
N$62  (via drill 1.02)
  other vias: 33.02,33.02
N$63  (via drill 1.02)
  other vias: 33.02,35.56
N$64  (via drill 1.02)
  other vias: 33.02,38.1
N$65  (via drill 1.02)
  other vias: 30.48,33.02
N$66  (via drill 1.02)
  other vias: 30.48,35.56
N$67  (via drill 1.02)
  other vias: 30.48,38.1
N$68  (via drill 1.02)
  other vias: 27.94,33.02
N$69  (via drill 1.02)
  other vias: 27.94,35.56
N$70  (via drill 1.02)
  other vias: 27.94,38.1
N$71  (via drill 1.02)
  other vias: 40.64,33.02
N$72  (via drill 1.02)
  other vias: 40.64,35.56
N$73  (via drill 1.02)
  other vias: 40.64,38.1
N$74  (via drill 1.02)
  other vias: 38.1,33.02
N$75  (via drill 1.02)
  other vias: 38.1,35.56
N$76  (via drill 1.02)
  other vias: 38.1,38.1
N$77  (via drill 1.02)
  other vias: 35.56,33.02
N$78  (via drill 1.02)
  other vias: 35.56,35.56
N$79  (via drill 1.02)
  other vias: 35.56,38.1
N$80  (via drill 1.02)
  other vias: 48.26,33.02
N$81  (via drill 1.02)
  other vias: 48.26,35.56
N$82  (via drill 1.02)
  other vias: 48.26,38.1
N$83  (via drill 1.02)
  other vias: 45.72,33.02
N$84  (via drill 1.02)
  other vias: 45.72,35.56
N$85  (via drill 1.02)
  other vias: 45.72,38.1
N$86  (via drill 1.02)
  other vias: 43.18,33.02
N$87  (via drill 1.02)
  other vias: 43.18,35.56
N$88  (via drill 1.02)
  other vias: 43.18,38.1
N$89  (via drill 1.02)
  other vias: 55.88,33.02
N$90  (via drill 1.02)
  other vias: 55.88,35.56
N$91  (via drill 1.02)
  other vias: 55.88,38.1
N$92  (via drill 1.02)
  other vias: 53.34,33.02
N$93  (via drill 1.02)
  other vias: 53.34,35.56
N$94  (via drill 1.02)
  other vias: 53.34,38.1
N$95  (via drill 1.02)
  other vias: 50.8,33.02
N$96  (via drill 1.02)
  other vias: 50.8,35.56
N$97  (via drill 1.02)
  other vias: 50.8,38.1
N$98  (via drill 0.5)
  other vias: 6.35,13.97
N$99  (via drill 0.5)
  other vias: 5.08,13.97
N$100  (via drill 1.02)
  other vias: 63.5,38.1
N$101  (via drill 1.02)
  other vias: 60.96,33.02
N$102  (via drill 1.02)
  other vias: 60.96,35.56
N$103  (via drill 1.02)
  other vias: 60.96,38.1
N$104  (via drill 1.02)
  other vias: 58.42,33.02
N$105  (via drill 1.02)
  other vias: 58.42,35.56
N$106  (via drill 1.02)
  other vias: 58.42,38.1
N$107  (via drill 0.5)
  other vias: 3.81,13.97
N$108  (via drill 0.5)
  other vias: 2.54,13.97
N$109  (via drill 0.5)
  other vias: 3.81,21.59
N$110  (via drill 0.5)
  other vias: 2.54,21.59
N$111  (via drill 0.5)
  other vias: 1.27,21.59
N$112  (via drill 0.5)
  other vias: 1.27,13.97
N$113
  Top 0.254: IC2.2 15.77,35.79 16.76,34.8 18.67,34.8 19.65,33.82 R12.2
  Top 0.305: R12.2 19.65,30.95 X2.2 18.92,27.34 C12.2
N$114
  Top 0.305: R13.2 16.09,32.22 X2.1 13.12,29.25 C13.2
  Top 0.406: R13.2 R12.1
N$117
  Top 0.254: C6.1 9.99,44.11 11.18,42.93 13.08,42.93 13.97,42.04 13.97,40.64 14.24,40.37 IC2.27
N$120  (via drill 1.02)
  other vias: 53.34,27.94
N$121  (via drill 1.02)
  other vias: 53.34,30.48
N$122  (via drill 1.02)
  other vias: 53.34,20.32
N$123  (via drill 1.02)
  other vias: 53.34,22.86
N$124  (via drill 1.02)
  other vias: 53.34,25.4
N$125  (via drill 1.02)
  other vias: 48.26,27.94
N$126  (via drill 1.02)
  other vias: 48.26,30.48
N$127  (via drill 1.02)
  other vias: 48.26,20.32
N$128  (via drill 1.02)
  other vias: 48.26,22.86
N$129  (via drill 1.02)
  other vias: 48.26,25.4
N$130  (via drill 1.02)
  other vias: 55.88,27.94
N$131  (via drill 1.02)
  other vias: 55.88,30.48
N$132  (via drill 1.02)
  other vias: 55.88,20.32
N$133  (via drill 1.02)
  other vias: 55.88,22.86
N$134  (via drill 1.02)
  other vias: 55.88,25.4
N$135  (via drill 1.02)
  other vias: 58.42,27.94
N$136  (via drill 1.02)
  other vias: 58.42,30.48
N$137  (via drill 1.02)
  other vias: 58.42,20.32
N$138  (via drill 1.02)
  other vias: 58.42,22.86
N$139  (via drill 1.02)
  other vias: 58.42,25.4
N$140  (via drill 1.02)
  other vias: 45.72,27.94
N$141  (via drill 1.02)
  other vias: 45.72,30.48
N$142  (via drill 1.02)
  other vias: 45.72,20.32
N$143  (via drill 1.02)
  other vias: 45.72,22.86
N$144  (via drill 1.02)
  other vias: 45.72,25.4
N$145  (via drill 1.02)
  other vias: 50.8,27.94
N$146  (via drill 1.02)
  other vias: 50.8,20.32
N$147  (via drill 1.02)
  other vias: 50.8,22.86
N$148  (via drill 1.02)
  other vias: 50.8,25.4
N$149  (via drill 1.02)
  other vias: 60.96,27.94
N$150  (via drill 1.02)
  other vias: 60.96,30.48
N$151  (via drill 1.02)
  other vias: 60.96,20.32
N$152  (via drill 1.02)
  other vias: 60.96,22.86
N$153  (via drill 1.02)
  other vias: 60.96,25.4
RD+
  Top 0.254: IC2.29 14.7,39.39 14.31,39.39 13.46,40.24 13.46,40.89 12.61,41.74 R15.1
RD-
  Top 0.254: IC2.30 14.71,38.86 13.97,38.86 13.21,38.1 13.21,36.49 R14.1
RESET  (via drill 0.5)
  Top 0.254: 55.88,15.88 S1.4 51.02,15.88 R1.1 | 55.88,15.88 S1.3 | v55.88,16 55.88,15.88 | v22.1,41.2 22.01,41.12 | IC1.4 31.1,19.3 v29.72,19.3
  Top 0.406: 22.01,41.12 C8.2
  Bottom 0.254: 63.64,21.59 P2.5 63.55,25.35 62.23,26.67 44.7,26.67 42.93,28.45 39.88,28.45 38.1,30.23 30.48,30.23 29.72,29.46 29.72,25.15 30.23,24.64 30.23,19.81 v29.72,19.3 25.91,19.3 24.13,21.08 24.13,29.97 25.15,30.99 25.15,32.51 | 63.64,21.59 63.64,20.21 59.44,16 v55.88,16 | J1.3 34.54,1.02 64.01,1.02 64.77,1.78 64.77,4.32 62.74,6.35 62.74,9.65 65.79,12.7 65.79,20.83 65.02,21.59 63.64,21.59
  Bottom 0.305: 25.15,32.51 22.1,35.56 v22.1,41.2
RESET2
  Top 0.254: 11.18,43.94 11.68,43.43 13.46,43.43 14.76,42.14 15.06,42.14 IC2.24 | R11.1 P3.5
  Top 0.305: P3.5 11.18,45.97 11.18,43.94
RXLED  (via drill 0.5)
  Top 0.305: IC2.10 20.05,38.37 v20.7,37.72
  Top 0.406: R2.1 22.01,27.47 v22.86,28.32
  Bottom 0.305: v20.7,37.72 21.34,37.08 21.34,35.31 24.38,32.26 24.38,31.24 22.86,29.72 v22.86,28.32
SCK2
  Top 0.305: IC2.15 19.79,40.87 20.07,41.15 20.07,47.5 19.05,48.51 16.76,48.51 15.49,47.24 P3.3
SCL  (via drill 0.5)
  Top 0.254: v62.74,34.29 62.74,31.75 62.23,31.24 62.23,21.84 62.48,21.59 62.48,11.43 61.98,10.92 52.83,10.92 51.56,9.65 44.2,9.65 42.42,11.43 v41.4,11.43 | IC1.19 39.01,19.81 40.13,19.81 41.4,21.08 41.4,22.61 v40.89,23.11
  Bottom 0.254: v40.89,23.11 41.4,22.61 v41.4,11.43 | v62.74,34.29 62.74,36.32 62.23,36.83 62.23,47.5 62.74,48.01 64.26,48.01 65.02,48.77
  Bottom 0.305: 65.02,48.77 65.02,51.56 64.26,52.32 20.32,52.32 J3.10
SDA  (via drill 0.5)
  Top 0.254: 60.96,16 v60.96,12.45 | IC1.20 39.2,20.32 39.88,20.32 40.39,20.83 v40.39,21.84 | 59.69,33.78 59.69,47.5 60.71,48.51 64.26,48.51 65.02,49.28 65.02,51.56 | v40.39,12.95 41.91,12.95 43.43,14.48 v45.97,14.48
  Top 0.305: 65.02,51.56 64.26,52.32 22.86,52.32 J3.9 | 59.69,33.78 59.69,17.27 60.96,16
  Bottom 0.254: v40.39,21.84 v40.39,12.95 | v60.96,12.45 59.69,11.18 49.28,11.18 v45.97,14.48
TXLED  (via drill 0.5)
  Top 0.305: R3.1 22.01,24.8 21.97,24.77 | IC2.11 20.59,38.87 v20.7,38.99
  Top 0.406: 21.97,24.77 v21.97,23.88
  Bottom 0.305: v21.97,23.88 21.84,24 21.84,29.72 23.5,31.37 23.5,32.13 20.57,35.05 20.57,36.58 19.81,37.34 19.81,38.1 v20.7,38.99
USB+  (via drill 0.5)
  Top 0.254: P1.A9 7.02,36.81 P1.B4 | P1.A4 7.02,39.31 P1.B9
  Top 0.61: 1.65,30.23 F1.1 | 1.65,30.23 v1.65,30.86 | v1.65,29.59 1.65,30.23
  Bottom 0.508: v1.65,30.86 8.51,30.86 9.65,32 9.65,36.32 | 9.65,36.32 10.19,36.86 11.2,36.86 12.7,38.35 12.7,39.37 12.19,39.88 10.92,39.88 10.3,39.26 P1.B9 | 9.65,36.32 9.12,36.86 P1.B4
  Bottom 0.61: v1.65,30.86 v1.65,29.59
USBRXD
  Top 0.254: IC2.9 20.49,36.7 20.95,36.7 21.97,37.72 21.97,38.35 22.01,38.39 R5.2
USBTXD
  Top 0.305: R4.2 19.56,35.81 18.77,36.6 IC2.8
USBVCC
  Top 0.254: IC2.31 14.24,38.37 13.72,37.85 13.72,35.05 10.16,31.5 7.37,31.5 7.28,31.41 F1.2
  Top 0.61: Q1.3 9.4,29.21 8.38,30.23 F1.2
VIN  (via drill 0.5)
  Top 0.406: 17.69,11.18 17.78,11.26 C1.+
  Top 0.813: IC3.3 12.71,20.06 13.34,19.43 R8.2
  Top 1.422: 17.69,11.18 16,11.18 14.73,12.45 10.16,12.45 8.64,13.97 8.64,16.76 11.17,19.3 IC3.3 | v20.7,8.26 v21.46,7.62 | D1.C 22.35,3.98 22.35,6.6 v20.7,8.26 | v20.7,8.26 17.78,11.18 C1.+
  Bottom 1.422: J1.8 45.72,5.08 45.21,5.59 23.81,5.59 v21.46,7.62 v20.7,8.26
XTL1
  Top 0.254: IC1.8 32.26,17.64 32.26,15.75 34.8,13.21 X1.1 37.43,12.23 R6.1
  Top 0.406: C3.2 R6.1
XTL2
  Top 0.254: IC1.7 31.62,17.71 X1.2 33.87,10.96 C2.2
  Top 0.406: C2.2 R6.2
(copper drawn outside any net)
  shapes: Bottom area x1, Top area x1

### Text on the board
tPlace: BabyBear | by Jon Oxer | SCL | SDA | A | GND | 13 | 12 | 11 | 10 | 9 | 8 | 7 | 6 | 5 | 4 | 3 | 2 | 1 | 0 | 1 | REF | PWM | PWM | PWM | Digital | PWM | PWM | PWM | TX | RX | UBOOT | v2.0 | ICSP-USB | -EN | RESET | 1 | ICSP | freetronics | PWR | RX | Reset | USB | TX | 7-12V | D13 | DC | www.freetronics.com/bb | IO | Power | Analog Inputs | REF | RST | 3V3 | 5V | GND | GND | VIN | 0 | 1 | 2 | 3 | 4 | 5 | 2.1mm
bPlace: BabyBear | v2.0 | SCL | SDA | A | GND | 13 | 12 | 11 | 10 | 9 | 8 | 7 | 6 | 5 | 4 | 3 | 2 | 1 | 0 | REF | PWM | PWM | PWM | Digital | PWM | PWM | PWM | TX | RX | +5V | GND | freetronics | ROHS | www.freetronics.com/bb | SKU: BB | IO | Power | Analog Inputs | REF | RST | 3V3 | 5V | GND | GND | VIN | 0 | 1 | 2 | 3 | 4 | 5
tNames: IC1
tDocu: K | A | K | A | K | A | K | A